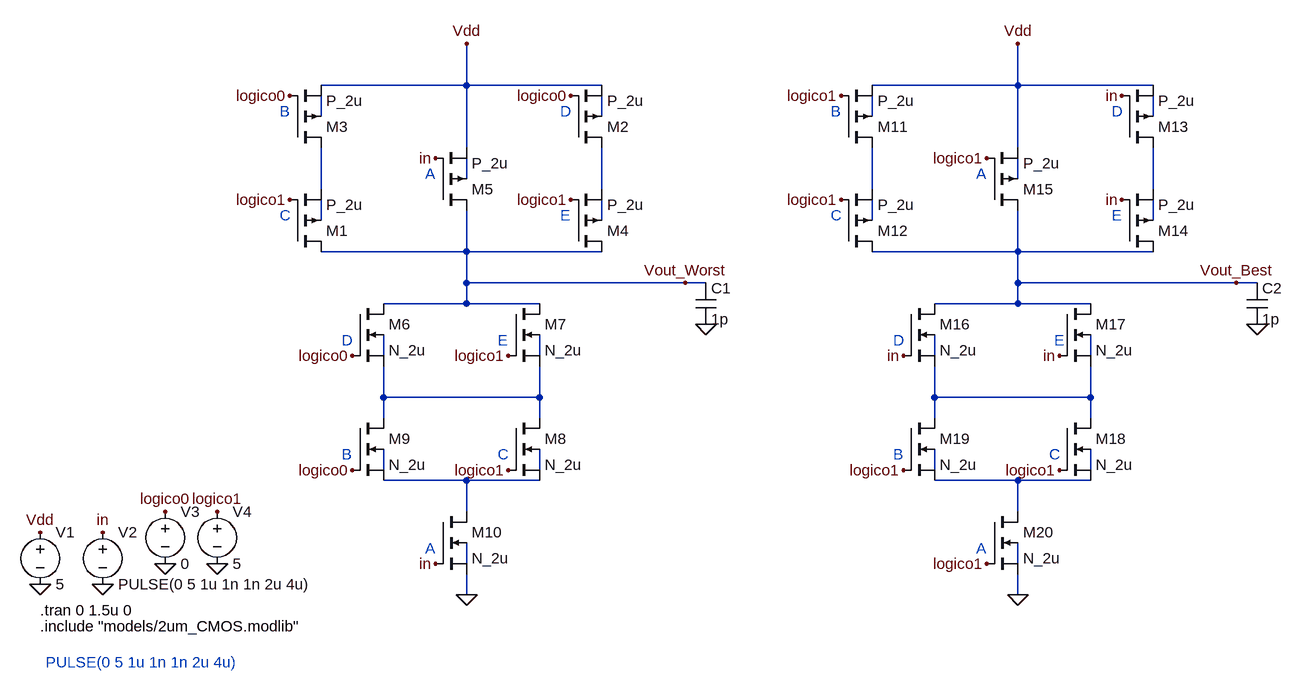
[diagram p0: schematic 2b.asc]
2b.asc, the LTspice schematic file:
Version 4
SHEET 1 1388 904
WIRE 128 -32 128 -96
WIRE 128 -32 -96 -32
WIRE 336 -32 128 -32
WIRE 976 -32 976 -96
WIRE 976 -32 752 -32
WIRE 1184 -32 976 -32
WIRE -96 16 -96 -16
WIRE 336 16 336 -16
WIRE 752 16 752 -16
WIRE 1184 16 1184 -16
WIRE 128 64 128 -32
WIRE 976 64 976 -32
WIRE 128 112 128 80
WIRE 976 112 976 80
WIRE -96 128 -96 64
WIRE 336 128 336 64
WIRE 752 128 752 64
WIRE 1184 128 1184 64
WIRE -96 176 -96 144
WIRE 336 176 336 144
WIRE 752 176 752 144
WIRE 1184 176 1184 144
WIRE 128 224 128 160
WIRE 128 224 -96 224
WIRE 336 224 128 224
WIRE 976 224 976 160
WIRE 976 224 752 224
WIRE 1184 224 976 224
WIRE 128 272 128 224
WIRE 464 272 128 272
WIRE 496 272 464 272
WIRE 976 272 976 224
WIRE 1312 272 976 272
WIRE 1344 272 1312 272
WIRE 128 304 128 272
WIRE 128 304 0 304
WIRE 240 304 128 304
WIRE 976 304 976 272
WIRE 976 304 848 304
WIRE 1088 304 976 304
WIRE 0 384 0 352
WIRE 240 384 240 352
WIRE 848 384 848 352
WIRE 1088 384 1088 352
WIRE 0 448 0 400
WIRE 240 448 240 400
WIRE 240 448 0 448
WIRE 848 448 848 400
WIRE 1088 448 1088 400
WIRE 1088 448 848 448
WIRE 0 480 0 448
WIRE 240 480 240 448
WIRE 848 480 848 448
WIRE 1088 480 1088 448
WIRE 0 560 0 528
WIRE 240 560 240 528
WIRE 848 560 848 528
WIRE 1088 560 1088 528
WIRE 128 576 0 576
WIRE 240 576 128 576
WIRE 976 576 848 576
WIRE 1088 576 976 576
WIRE 128 624 128 576
WIRE 976 624 976 576
WIRE 128 704 128 672
WIRE 976 704 976 672
WIRE 128 752 128 720
WIRE 976 752 976 720
FLAG 128 -96 Vdd
FLAG 128 752 0
FLAG -528 736 0
FLAG -432 736 0
FLAG -336 704 0
FLAG -256 704 0
FLAG -528 656 Vdd
FLAG -432 656 in
FLAG -336 624 logico0
FLAG -256 624 logico1
FLAG 464 272 Vout_Worst
FLAG 496 336 0
FLAG 976 -96 Vdd
FLAG 976 752 0
FLAG 1312 272 Vout_Best
FLAG 1344 336 0
FLAG 80 704 in
FLAG -48 560 logico0
FLAG -48 384 logico0
FLAG 192 384 logico1
FLAG 192 560 logico1
FLAG 80 80 in
FLAG -144 -16 logico0
FLAG 288 -16 logico0
FLAG 288 144 logico1
FLAG -144 144 logico1
FLAG 800 384 in
FLAG 1040 384 in
FLAG 800 560 logico1
FLAG 1040 560 logico1
FLAG 928 704 logico1
FLAG 1136 -16 in
FLAG 1136 144 in
FLAG 704 -16 logico1
FLAG 704 144 logico1
FLAG 928 80 logico1
SYMBOL voltage -528 640 R0
WINDOW 123 0 0 Left 0
WINDOW 39 0 0 Left 0
SYMATTR InstName V1
SYMATTR Value 5
SYMBOL voltage -432 640 R0
WINDOW 123 0 0 Left 0
WINDOW 39 0 0 Left 0
SYMATTR InstName V2
SYMATTR Value PULSE(0 5 1u 1n 1n 2u 4u)
SYMBOL voltage -336 608 R0
WINDOW 123 0 0 Left 0
WINDOW 39 0 0 Left 0
SYMATTR InstName V3
SYMATTR Value 0
SYMBOL voltage -256 608 R0
WINDOW 123 0 0 Left 0
WINDOW 39 0 0 Left 0
SYMATTR InstName V4
SYMATTR Value 5
SYMBOL pmos4 -144 64 M180
SYMATTR InstName M3
SYMATTR Value P_2u
SYMATTR Value2 l=2u w=12u
SYMBOL pmos4 -144 224 M180
SYMATTR InstName M1
SYMATTR Value P_2u
SYMATTR Value2 l=2u w=12u
SYMBOL pmos4 288 64 M180
SYMATTR InstName M2
SYMATTR Value P_2u
SYMATTR Value2 l=2u w=12u
SYMBOL pmos4 288 224 M180
SYMATTR InstName M4
SYMATTR Value P_2u
SYMATTR Value2 l=2u w=12u
SYMBOL pmos4 80 160 M180
SYMATTR InstName M5
SYMATTR Value P_2u
SYMATTR Value2 l=2u w=6u
SYMBOL nmos4 -48 304 R0
SYMATTR InstName M6
SYMATTR Value N_2u
SYMATTR Value2 l=2u w=12u
SYMBOL nmos4 192 304 R0
SYMATTR InstName M7
SYMATTR Value N_2u
SYMATTR Value2 l=2u w=12u
SYMBOL nmos4 192 480 R0
SYMATTR InstName M8
SYMATTR Value N_2u
SYMATTR Value2 l=2u w=12u
SYMBOL nmos4 -48 480 R0
SYMATTR InstName M9
SYMATTR Value N_2u
SYMATTR Value2 l=2u w=12u
SYMBOL nmos4 80 624 R0
SYMATTR InstName M10
SYMATTR Value N_2u
SYMATTR Value2 l=2u w=12u
SYMBOL cap 480 272 R0
SYMATTR InstName C1
SYMATTR Value 1p
SYMBOL pmos4 704 64 M180
SYMATTR InstName M11
SYMATTR Value P_2u
SYMATTR Value2 l=2u w=12u
SYMBOL pmos4 704 224 M180
SYMATTR InstName M12
SYMATTR Value P_2u
SYMATTR Value2 l=2u w=12u
SYMBOL pmos4 1136 64 M180
SYMATTR InstName M13
SYMATTR Value P_2u
SYMATTR Value2 l=2u w=12u
SYMBOL pmos4 1136 224 M180
SYMATTR InstName M14
SYMATTR Value P_2u
SYMATTR Value2 l=2u w=12u
SYMBOL pmos4 928 160 M180
SYMATTR InstName M15
SYMATTR Value P_2u
SYMATTR Value2 l=2u w=6u
SYMBOL nmos4 800 304 R0
SYMATTR InstName M16
SYMATTR Value N_2u
SYMATTR Value2 l=2u w=12u
SYMBOL nmos4 1040 304 R0
SYMATTR InstName M17
SYMATTR Value N_2u
SYMATTR Value2 l=2u w=12u
SYMBOL nmos4 1040 480 R0
SYMATTR InstName M18
SYMATTR Value N_2u
SYMATTR Value2 l=2u w=12u
SYMBOL nmos4 800 480 R0
SYMATTR InstName M19
SYMATTR Value N_2u
SYMATTR Value2 l=2u w=12u
SYMBOL nmos4 928 624 R0
SYMATTR InstName M20
SYMATTR Value N_2u
SYMATTR Value2 l=2u w=12u
SYMBOL cap 1328 272 R0
SYMATTR InstName C2
SYMATTR Value 1p
TEXT -528 776 Left 2 !.tran 0 1.5u 0
TEXT -528 800 Left 2 !.include "models/2um_CMOS.modlib"
TEXT -520 856 Left 2 ;PULSE(0 5 1u 1n 1n 2u 4u)
TEXT 64 104 Left 2 ;A
TEXT 64 680 Left 2 ;A
TEXT 912 104 Left 2 ;A
TEXT 912 680 Left 2 ;A
TEXT -160 8 Left 2 ;B
TEXT -160 168 Left 2 ;C
TEXT 272 8 Left 2 ;D
TEXT 272 168 Left 2 ;E
TEXT 688 8 Left 2 ;B
TEXT 688 168 Left 2 ;C
TEXT 1120 168 Left 2 ;E
TEXT 1120 8 Left 2 ;D
TEXT -64 536 Left 2 ;B
TEXT 176 536 Left 2 ;C
TEXT -64 360 Left 2 ;D
TEXT 176 360 Left 2 ;E
TEXT 784 360 Left 2 ;D
TEXT 1032 360 Left 2 ;E
TEXT 784 536 Left 2 ;B
TEXT 1024 536 Left 2 ;C

The netlist it stands for:
* 2b.asc
V1 Vdd 0 5
V2 in 0 PULSE(0 5 1u 1n 1n 2u 4u)
V3 logico0 0 0
V4 logico1 0 5
M3 N007 logico0 Vdd N001 P_2u l=2u w=12u
M1 Vout_Worst logico1 N007 N011 P_2u l=2u w=12u
M2 N008 logico0 Vdd N002 P_2u l=2u w=12u
M4 Vout_Worst logico1 N008 N012 P_2u l=2u w=12u
M5 Vout_Worst in Vdd N005 P_2u l=2u w=6u
M6 Vout_Worst logico0 N019 N015 N_2u l=2u w=12u
M7 Vout_Worst logico1 N019 N016 N_2u l=2u w=12u
M8 N019 logico1 N025 N022 N_2u l=2u w=12u
M9 N019 logico0 N025 N021 N_2u l=2u w=12u
M10 N025 in 0 N027 N_2u l=2u w=12u
C1 Vout_Worst 0 1p
M11 N009 logico1 Vdd N003 P_2u l=2u w=12u
M12 Vout_Best logico1 N009 N013 P_2u l=2u w=12u
M13 N010 in Vdd N004 P_2u l=2u w=12u
M14 Vout_Best in N010 N014 P_2u l=2u w=12u
M15 Vout_Best logico1 Vdd N006 P_2u l=2u w=6u
M16 Vout_Best in N020 N017 N_2u l=2u w=12u
M17 Vout_Best in N020 N018 N_2u l=2u w=12u
M18 N020 logico1 N026 N024 N_2u l=2u w=12u
M19 N020 logico1 N026 N023 N_2u l=2u w=12u
M20 N026 logico1 0 N028 N_2u l=2u w=12u
C2 Vout_Best 0 1p
.model NMOS NMOS
.model PMOS PMOS
.lib standard.mos
.tran 0 1.5u 0
.include "models/2um_CMOS.modlib"
* PULSE(0 5 1u 1n 1n 2u 4u)
* A
* A
* A
* A
* B
* C
* D
* E
* B
* C
* E
* D
* B
* C
* D
* E
* D
* E
* B
* C
.backanno
.end